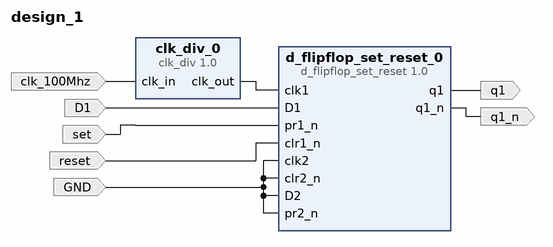
[diagram p0: block diagram of the top level]
# Vivado block design design_1, Vivado 2014.2
create_bd_design design_1

create_bd_port -dir I -type data set
create_bd_port -dir I -type clk clk_100Mhz
create_bd_port -dir I -type data reset
create_bd_port -dir I -type data D1
create_bd_port -dir I -type data GND
create_bd_port -dir O -type data q1
create_bd_port -dir O -type data q1_n

create_bd_cell -type ip -vlnv xilinx.com:xup:clk_div:1.0 clk_div_0
create_bd_cell -type ip -vlnv xilinx.com:XUP:d_flipflop_set_reset:1.0 d_flipflop_set_reset_0

# ---- connections ----

connect_bd_net -net D1_1 [get_bd_ports D1] [get_bd_pins d_flipflop_set_reset_0/D1]
connect_bd_net [get_bd_ports clk_100Mhz] [get_bd_pins clk_div_0/clk_in]
connect_bd_net [get_bd_pins clk_div_0/clk_out] [get_bd_pins d_flipflop_set_reset_0/clk1]
connect_bd_net [get_bd_ports set] [get_bd_pins d_flipflop_set_reset_0/pr1_n]
connect_bd_net [get_bd_ports reset] [get_bd_pins d_flipflop_set_reset_0/clr1_n]
connect_bd_net [get_bd_pins d_flipflop_set_reset_0/q1] [get_bd_ports q1]
connect_bd_net [get_bd_pins d_flipflop_set_reset_0/q1_n] [get_bd_ports q1_n]
connect_bd_net [get_bd_ports GND] \
  [get_bd_pins d_flipflop_set_reset_0/clk2] [get_bd_pins d_flipflop_set_reset_0/pr2_n] \
  [get_bd_pins d_flipflop_set_reset_0/clr2_n] [get_bd_pins d_flipflop_set_reset_0/D2]

validate_bd_design
save_bd_design
